# Altium schematic sheet Ethernet & PMOD.SchDoc
size A3; SheetNumber: 11; SheetTotal: 11
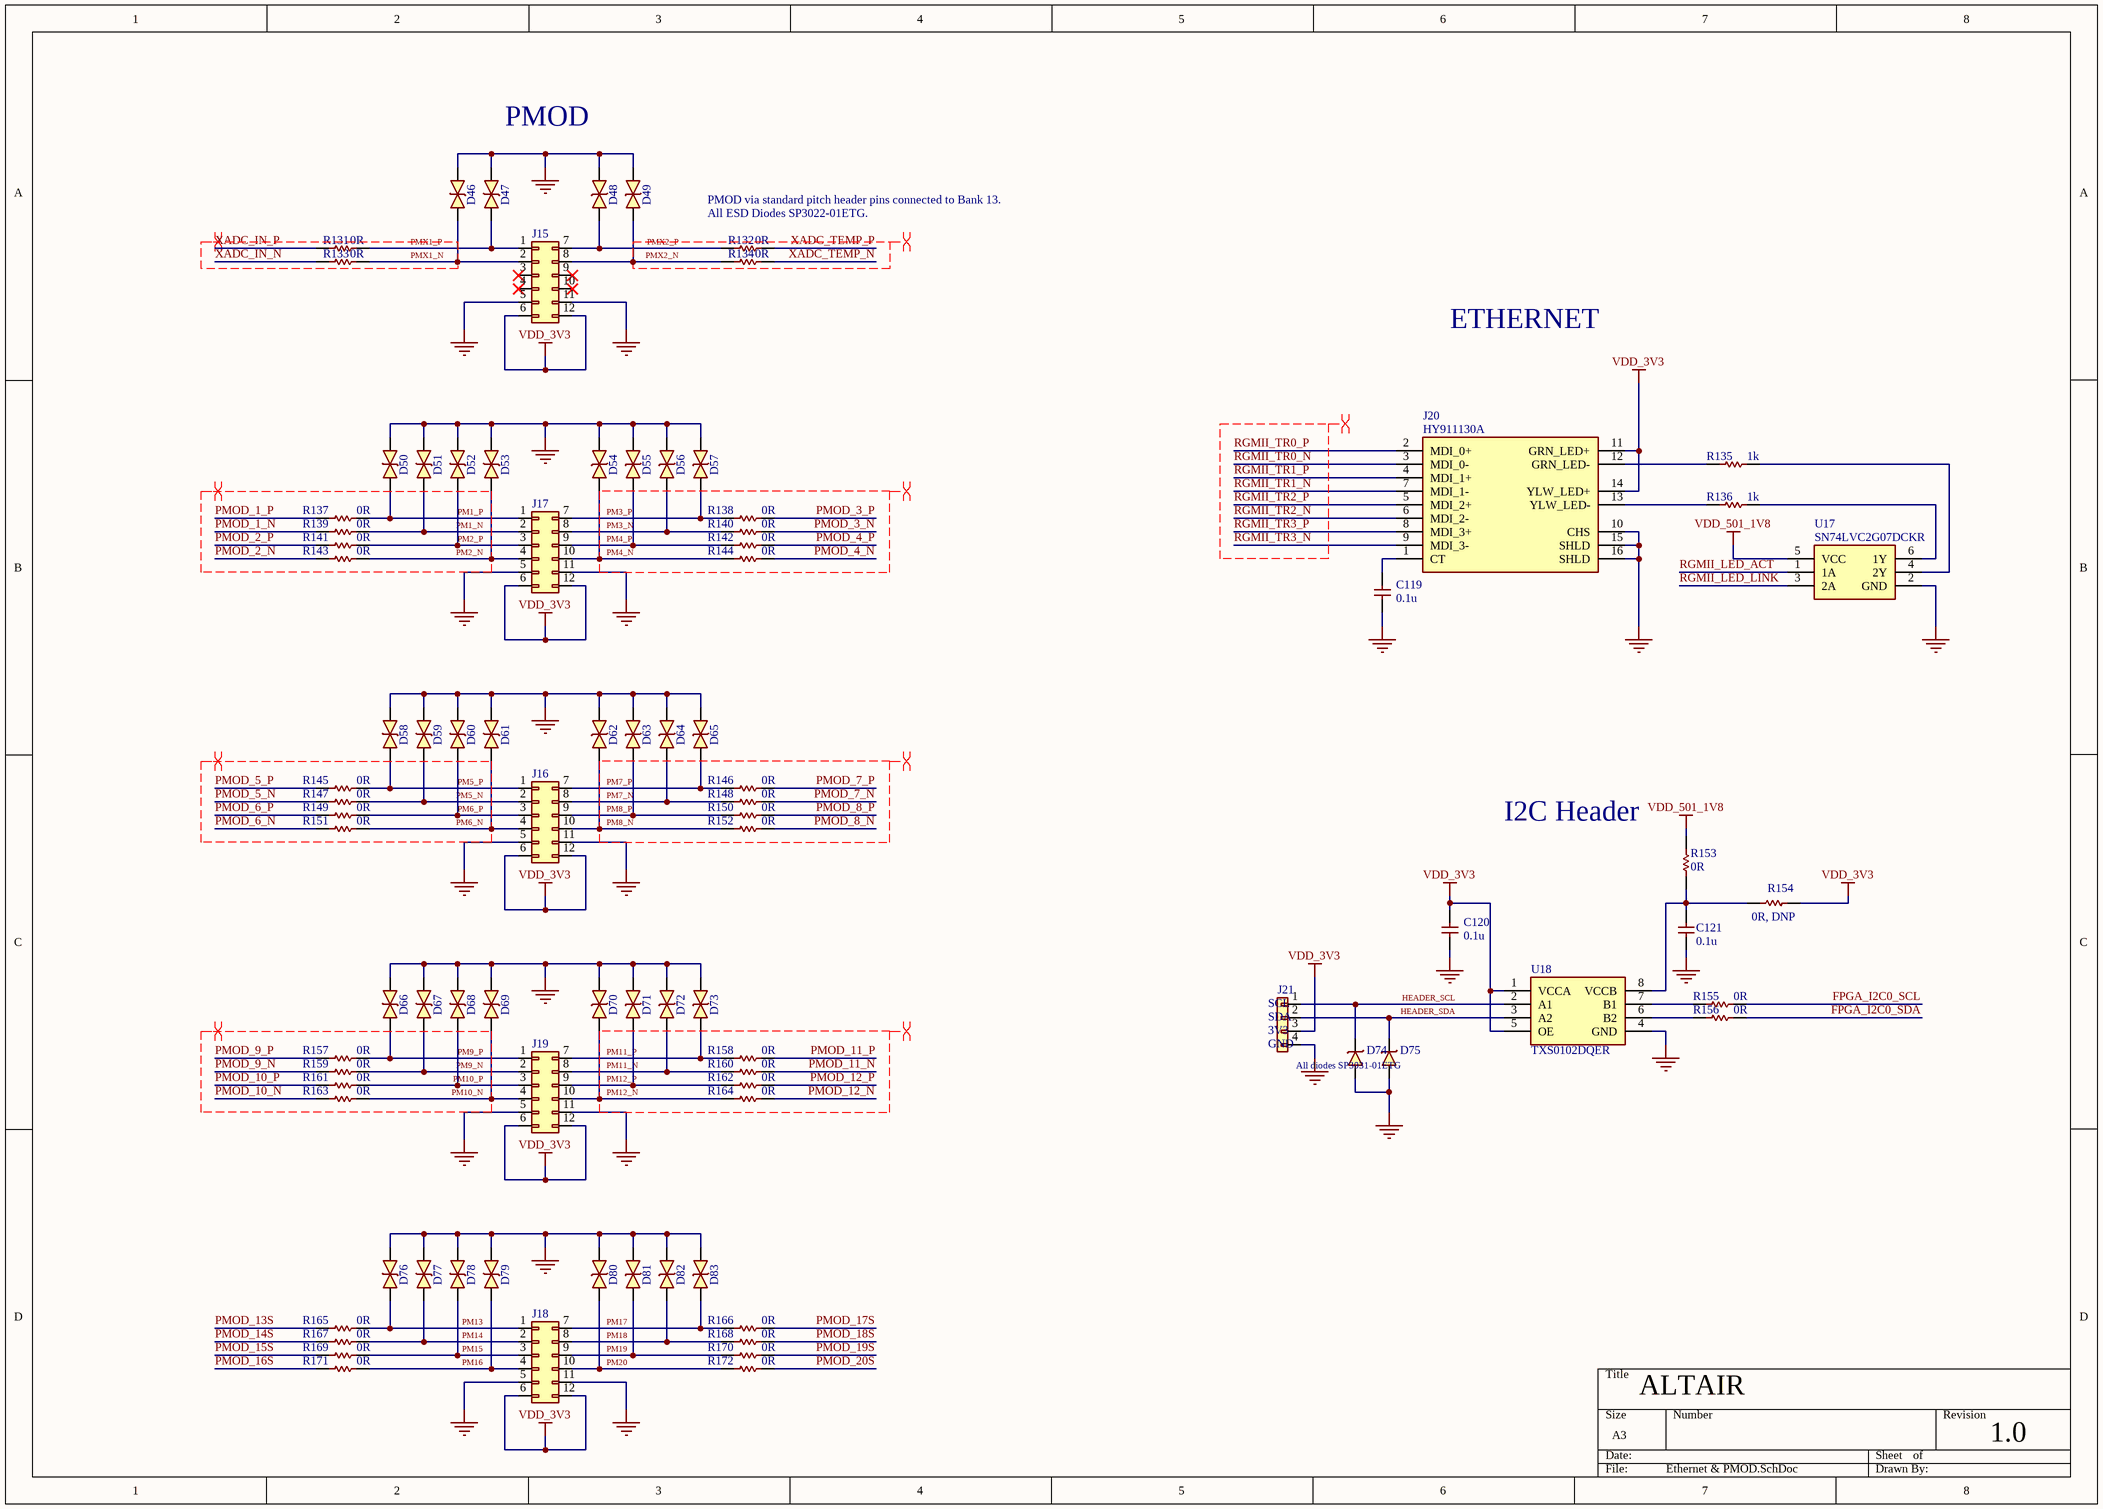
[diagram p0: Ethernet & PMOD.SchDoc]

## Parts
C119  0.1u  [CAP_0402]
C120  0.1u  [CAP_0402]
C121  0.1u  [CAP_0402]
D46  SP3022-01ETG  [SP302201ETGNM]  (value not drawn)
D47  SP3022-01ETG  [SP302201ETGNM]  (value not drawn)
D48  SP3022-01ETG  [SP302201ETGNM]  (value not drawn)
D49  SP3022-01ETG  [SP302201ETGNM]  (value not drawn)
D50  SP3022-01ETG  [SP302201ETGNM]  (value not drawn)
D51  SP3022-01ETG  [SP302201ETGNM]  (value not drawn)
D52  SP3022-01ETG  [SP302201ETGNM]  (value not drawn)
D53  SP3022-01ETG  [SP302201ETGNM]  (value not drawn)
D54  SP3022-01ETG  [SP302201ETGNM]  (value not drawn)
D55  SP3022-01ETG  [SP302201ETGNM]  (value not drawn)
D56  SP3022-01ETG  [SP302201ETGNM]  (value not drawn)
D57  SP3022-01ETG  [SP302201ETGNM]  (value not drawn)
D58  SP3022-01ETG  [SP302201ETGNM]  (value not drawn)
D59  SP3022-01ETG  [SP302201ETGNM]  (value not drawn)
D60  SP3022-01ETG  [SP302201ETGNM]  (value not drawn)
D61  SP3022-01ETG  [SP302201ETGNM]  (value not drawn)
D62  SP3022-01ETG  [SP302201ETGNM]  (value not drawn)
D63  SP3022-01ETG  [SP302201ETGNM]  (value not drawn)
D64  SP3022-01ETG  [SP302201ETGNM]  (value not drawn)
D65  SP3022-01ETG  [SP302201ETGNM]  (value not drawn)
D66  SP3022-01ETG  [SP302201ETGNM]  (value not drawn)
D67  SP3022-01ETG  [SP302201ETGNM]  (value not drawn)
D68  SP3022-01ETG  [SP302201ETGNM]  (value not drawn)
D69  SP3022-01ETG  [SP302201ETGNM]  (value not drawn)
D70  SP3022-01ETG  [SP302201ETGNM]  (value not drawn)
D71  SP3022-01ETG  [SP302201ETGNM]  (value not drawn)
D72  SP3022-01ETG  [SP302201ETGNM]  (value not drawn)
D73  SP3022-01ETG  [SP302201ETGNM]  (value not drawn)
D74  SP3031-01ETG  [SP303101ETG]  (value not drawn)
D75  SP3031-01ETG  [SP303101ETG]  (value not drawn)
D76  SP3022-01ETG  [SP302201ETGNM]  (value not drawn)
D77  SP3022-01ETG  [SP302201ETGNM]  (value not drawn)
D78  SP3022-01ETG  [SP302201ETGNM]  (value not drawn)
D79  SP3022-01ETG  [SP302201ETGNM]  (value not drawn)
D80  SP3022-01ETG  [SP302201ETGNM]  (value not drawn)
D81  SP3022-01ETG  [SP302201ETGNM]  (value not drawn)
D82  SP3022-01ETG  [SP302201ETGNM]  (value not drawn)
D83  SP3022-01ETG  [SP302201ETGNM]  (value not drawn)
J15  PMOD_HEADER  [PMOD_HEADER]  (value not drawn)
J16  PMOD_HEADER  [PMOD_HEADER]  (value not drawn)
J17  PMOD_HEADER  [PMOD_HEADER]  (value not drawn)
J18  PMOD_HEADER  [PMOD_HEADER]  (value not drawn)
J19  PMOD_HEADER  [PMOD_HEADER]  (value not drawn)
J20  HY911130A  [HY911130A]
J21  4xHeader  [HDRV4W95P0X254_1X4_1016X254X854P]  (value not drawn)
R131  0R  [RES_0402]
R132  0R  [RES_0402]
R133  0R  [RES_0402]
R134  0R  [RES_0402]
R135  1k  [RES_0402]
R136  1k  [RES_0402]
R137  0R  [RES_0402]
R138  0R  [RES_0402]
R139  0R  [RES_0402]
R140  0R  [RES_0402]
R141  0R  [RES_0402]
R142  0R  [RES_0402]
R143  0R  [RES_0402]
R144  0R  [RES_0402]
R145  0R  [RES_0402]
R146  0R  [RES_0402]
R147  0R  [RES_0402]
R148  0R  [RES_0402]
R149  0R  [RES_0402]
R150  0R  [RES_0402]
R151  0R  [RES_0402]
R152  0R  [RES_0402]
R153  0R  [RES_0402]
R154  0R, DNP  [RES_0402]
R155  0R  [RES_0402]
R156  0R  [RES_0402]
R157  0R  [RES_0402]
R158  0R  [RES_0402]
R159  0R  [RES_0402]
R160  0R  [RES_0402]
R161  0R  [RES_0402]
R162  0R  [RES_0402]
R163  0R  [RES_0402]
R164  0R  [RES_0402]
R165  0R  [RES_0402]
R166  0R  [RES_0402]
R167  0R  [RES_0402]
R168  0R  [RES_0402]
R169  0R  [RES_0402]
R170  0R  [RES_0402]
R171  0R  [RES_0402]
R172  0R  [RES_0402]
U17  SN74LVC2G07DCKR  [SOT65P210X110-6N]
U18  TXS0102DQER  [SON35P100X140X40-8N]

## Nets
GND: C119.1 C120.1 C121.1 D46.1 D47.1 D48.1 D49.1 D50.1 D51.1 D52.1 D53.1 D54.1 D55.1 D56.1 D57.1 D58.1 D59.1 D60.1 D61.1 D62.1 D63.1 D64.1 D65.1 D66.1 D67.1 D68.1 D69.1 D70.1 D71.1 D72.1 D73.1 D74.2(A) D75.2(A) D76.1 D77.1 D78.1 D79.1 D80.1 D81.1 D82.1 D83.1 J15.5 J15.11 J16.5 J16.11 J17.5 J17.11 J18.5 J18.11 J19.5 J19.11 J20.10(CHS) J20.15(SHLD) J20.16(SHLD) J21.4 U17.2(GND) U18.4(GND)
VDD_3V3: C120.2 J15.6 J15.12 J16.6 J16.12 J17.6 J17.12 J18.6 J18.12 J19.6 J19.12 J20.11(GRN_LED+) J20.14(YLW_LED+) J21.3 R154.2 U18.1(VCCA) U18.5(OE)
VDD_501_1V8: R153.2 U17.5(VCC)
FPGA_I2C0_SCL: R155.2
FPGA_I2C0_SDA: R156.2
HEADER_SCL: D74.1(K) J21.1 U18.2(A1)
HEADER_SDA: D75.1(K) J21.2 U18.3(A2)
PM1_N: D51.2 J17.2 R139.2
PM1_P: D50.2 J17.1 R137.2
PM2_N: D53.2 J17.4 R143.2
PM2_P: D52.2 J17.3 R141.2
PM3_N: D56.2 J17.8 R140.1
PM3_P: D57.2 J17.7 R138.1
PM4_N: D54.2 J17.10 R144.1
PM4_P: D55.2 J17.9 R142.1
PM5_N: D59.2 J16.2 R147.2
PM5_P: D58.2 J16.1 R145.2
PM6_N: D61.2 J16.4 R151.2
PM6_P: D60.2 J16.3 R149.2
PM7_N: D64.2 J16.8 R148.1
PM7_P: D65.2 J16.7 R146.1
PM8_N: D62.2 J16.10 R152.1
PM8_P: D63.2 J16.9 R150.1
PM9_N: D67.2 J19.2 R159.2
PM9_P: D66.2 J19.1 R157.2
PM10_N: D69.2 J19.4 R163.2
PM10_P: D68.2 J19.3 R161.2
PM11_N: D72.2 J19.8 R160.1
PM11_P: D73.2 J19.7 R158.1
PM12_N: D70.2 J19.10 R164.1
PM12_P: D71.2 J19.9 R162.1
PM13: D76.2 J18.1 R165.2
PM14: D77.2 J18.2 R167.2
PM15: D78.2 J18.3 R169.2
PM16: D79.2 J18.4 R171.2
PM17: D83.2 J18.7 R166.1
PM18: D82.2 J18.8 R168.1
PM19: D81.2 J18.9 R170.1
PM20: D80.2 J18.10 R172.1
PMOD_1_N: R139.1
PMOD_1_P: R137.1
PMOD_2_N: R143.1
PMOD_2_P: R141.1
PMOD_3_N: R140.2
PMOD_3_P: R138.2
PMOD_4_N: R144.2
PMOD_4_P: R142.2
PMOD_5_N: R147.1
PMOD_5_P: R145.1
PMOD_6_N: R151.1
PMOD_6_P: R149.1
PMOD_7_N: R148.2
PMOD_7_P: R146.2
PMOD_8_N: R152.2
PMOD_8_P: R150.2
PMOD_9_N: R159.1
PMOD_9_P: R157.1
PMOD_10_N: R163.1
PMOD_10_P: R161.1
PMOD_11_N: R160.2
PMOD_11_P: R158.2
PMOD_12_N: R164.2
PMOD_12_P: R162.2
PMOD_13S: R165.1
PMOD_14S: R167.1
PMOD_15S: R169.1
PMOD_16S: R171.1
PMOD_17S: R166.2
PMOD_18S: R168.2
PMOD_19S: R170.2
PMOD_20S: R172.2
PMX1_N: D46.2 J15.2 R133.2
PMX1_P: D47.2 J15.1 R131.2
PMX2_N: D49.2 J15.8 R134.1
PMX2_P: D48.2 J15.7 R132.1
RGMII_LED_ACT: U17.1(1A)
RGMII_LED_LINK: U17.3(2A)
RGMII_TR0_N: J20.3(MDI_0-)
RGMII_TR0_P: J20.2(MDI_0+)
RGMII_TR1_N: J20.7(MDI_1-)
RGMII_TR1_P: J20.4(MDI_1+)
RGMII_TR2_N: J20.6(MDI_2-)
RGMII_TR2_P: J20.5(MDI_2+)
RGMII_TR3_N: J20.9(MDI_3-)
RGMII_TR3_P: J20.8(MDI_3+)
XADC_IN_N: R133.1
XADC_IN_P: R131.1
XADC_TEMP_N: R134.2
XADC_TEMP_P: R132.2
NetC119_2: C119.2 J20.1(CT)
NetC121_2: C121.2 R153.1 R154.1 U18.8(VCCB)
NetJ20_12: J20.12(GRN_LED-) R135.1
NetJ20_13: J20.13(YLW_LED-) R136.1
NetR135_2: R135.2 U17.4(2Y)
NetR136_2: R136.2 U17.6(1Y)
NetR155_1: R155.1 U18.7(B1)
NetR156_1: R156.1 U18.6(B2)

Not connected (* = marked no-connect by the designer): J15 3* 4* 9* 10*

## Layout directives
differential pair: PM1_N, PM1_P, PM2_N, PM2_P, PM3_N, PM3_P, PM4_N, PM4_P, PM5_N, PM5_P, PM6_N, PM6_P, PM7_N, PM7_P, PM8_N, PM8_P, PM9_N, PM9_P, PM10_N, PM10_P, PM11_N, PM11_P, PM12_N, PM12_P, PMOD_1_N, PMOD_1_P, PMOD_2_N, PMOD_2_P, PMOD_3_N, PMOD_3_P, PMOD_4_N, PMOD_4_P, PMOD_5_N, PMOD_5_P, PMOD_6_N, PMOD_6_P, PMOD_7_N, PMOD_7_P, PMOD_8_N, PMOD_8_P, PMOD_9_N, PMOD_9_P, PMOD_10_N, PMOD_10_P, PMOD_11_N, PMOD_11_P, PMOD_12_N, PMOD_12_P, PMX1_N, PMX1_P, PMX2_N, PMX2_P, RGMII_TR0_N, RGMII_TR0_P, RGMII_TR1_N, RGMII_TR1_P, RGMII_TR2_N, RGMII_TR2_P, RGMII_TR3_N, RGMII_TR3_P, XADC_IN_N, XADC_IN_P, XADC_TEMP_N, XADC_TEMP_P

## Notes on the sheet
- PMOD
- PMOD via standard pitch header pins connected to Bank 13.
- All ESD Diodes SP3022-01ETG.
- ETHERNET
- (near R153) I2C Header
- (near J21) SCL
- (near J21) 3V3
- (near J21) SDA
- (near J21) GND
- (near D75) All diodes SP3031-01ETG
- ALTAIR
- 1.0

## Library data of the parts
C119-C121 = CAP_0402: Capacitor SMD 0402; Part No: CL05B104KO5NNNC; Note/Misc: 16V, 0402; LCSC: *; JLCPCB Part #: C338112; Footprint JLCPCB: 0402
D46-D73 D76-D83 = SP3022-01ETG: TVS Diode (Bi-directional); Footprint JLCPCB: SOD-882; JLCPCB Part #: C126840; Part No: SP3022-01ETG
D74 D75 = SP3031-01ETG: TVS Diode (Uni-directional); Footprint JLCPCB: SOD-882; JLCPCB Part #: C207283; LCSC: *; Note/Misc: *; Part No: SP3031-01ETG
J15-J17 J19 = PMOD_HEADER: NON-Standard 2x6 pin 2.54mm pitch connector. Right Angle; Part No: HC-PM254-8.5H-2x6PW; Footprint JLCPCB: Push-Pull,P=2.54mm; JLCPCB Part #: C22373932
J18 = PMOD_HEADER: NON-Standard 2x6 pin 2.54mm pitch connector. Right Angle
J20 = HY911130A: Ethernet Connector; LCSC: *; Note/Misc: *; Part No: HY911130A; JLCPCB Part #: C55679; Footprint JLCPCB: Plugin
J21 = 4xHeader: Standard 4 pin 2.54mm pitch connector; Part No: X6511WV-04H-C60D30; Footprint JLCPCB: Plugin,P=2.54mm; JLCPCB Part #: C706876
R131-R134 R137-R172 = RES_0402: Resistor SMD 0402; Part No: RC0402JR-070RL; LCSC: *; JLCPCB Part #: C60485; Footprint JLCPCB: 0402
  R154: Note/Misc: DNP
R135 R136 = RES_0402: Resistor SMD 0402; Part No: RC0402JR-071KL; LCSC: *; JLCPCB Part #: C105637; Footprint JLCPCB: 0402
U17 = SN74LVC2G07DCKR: Buffer Gate 1 input 1 output; Footprint JLCPCB: SC-70-6; JLCPCB Part #: C7849; Part No: SN74LVC2G07DCKR
U18 = TXS0102DQER: I2C UART Voltage Level Translator; LCSC: *; Note/Misc: *; Part No: TXS0102DQER; JLCPCB Part #: C2652935; Footprint JLCPCB: X2-SON-8(1x1.4)